# Altium schematic sheet Sheet1.SchDoc
size B
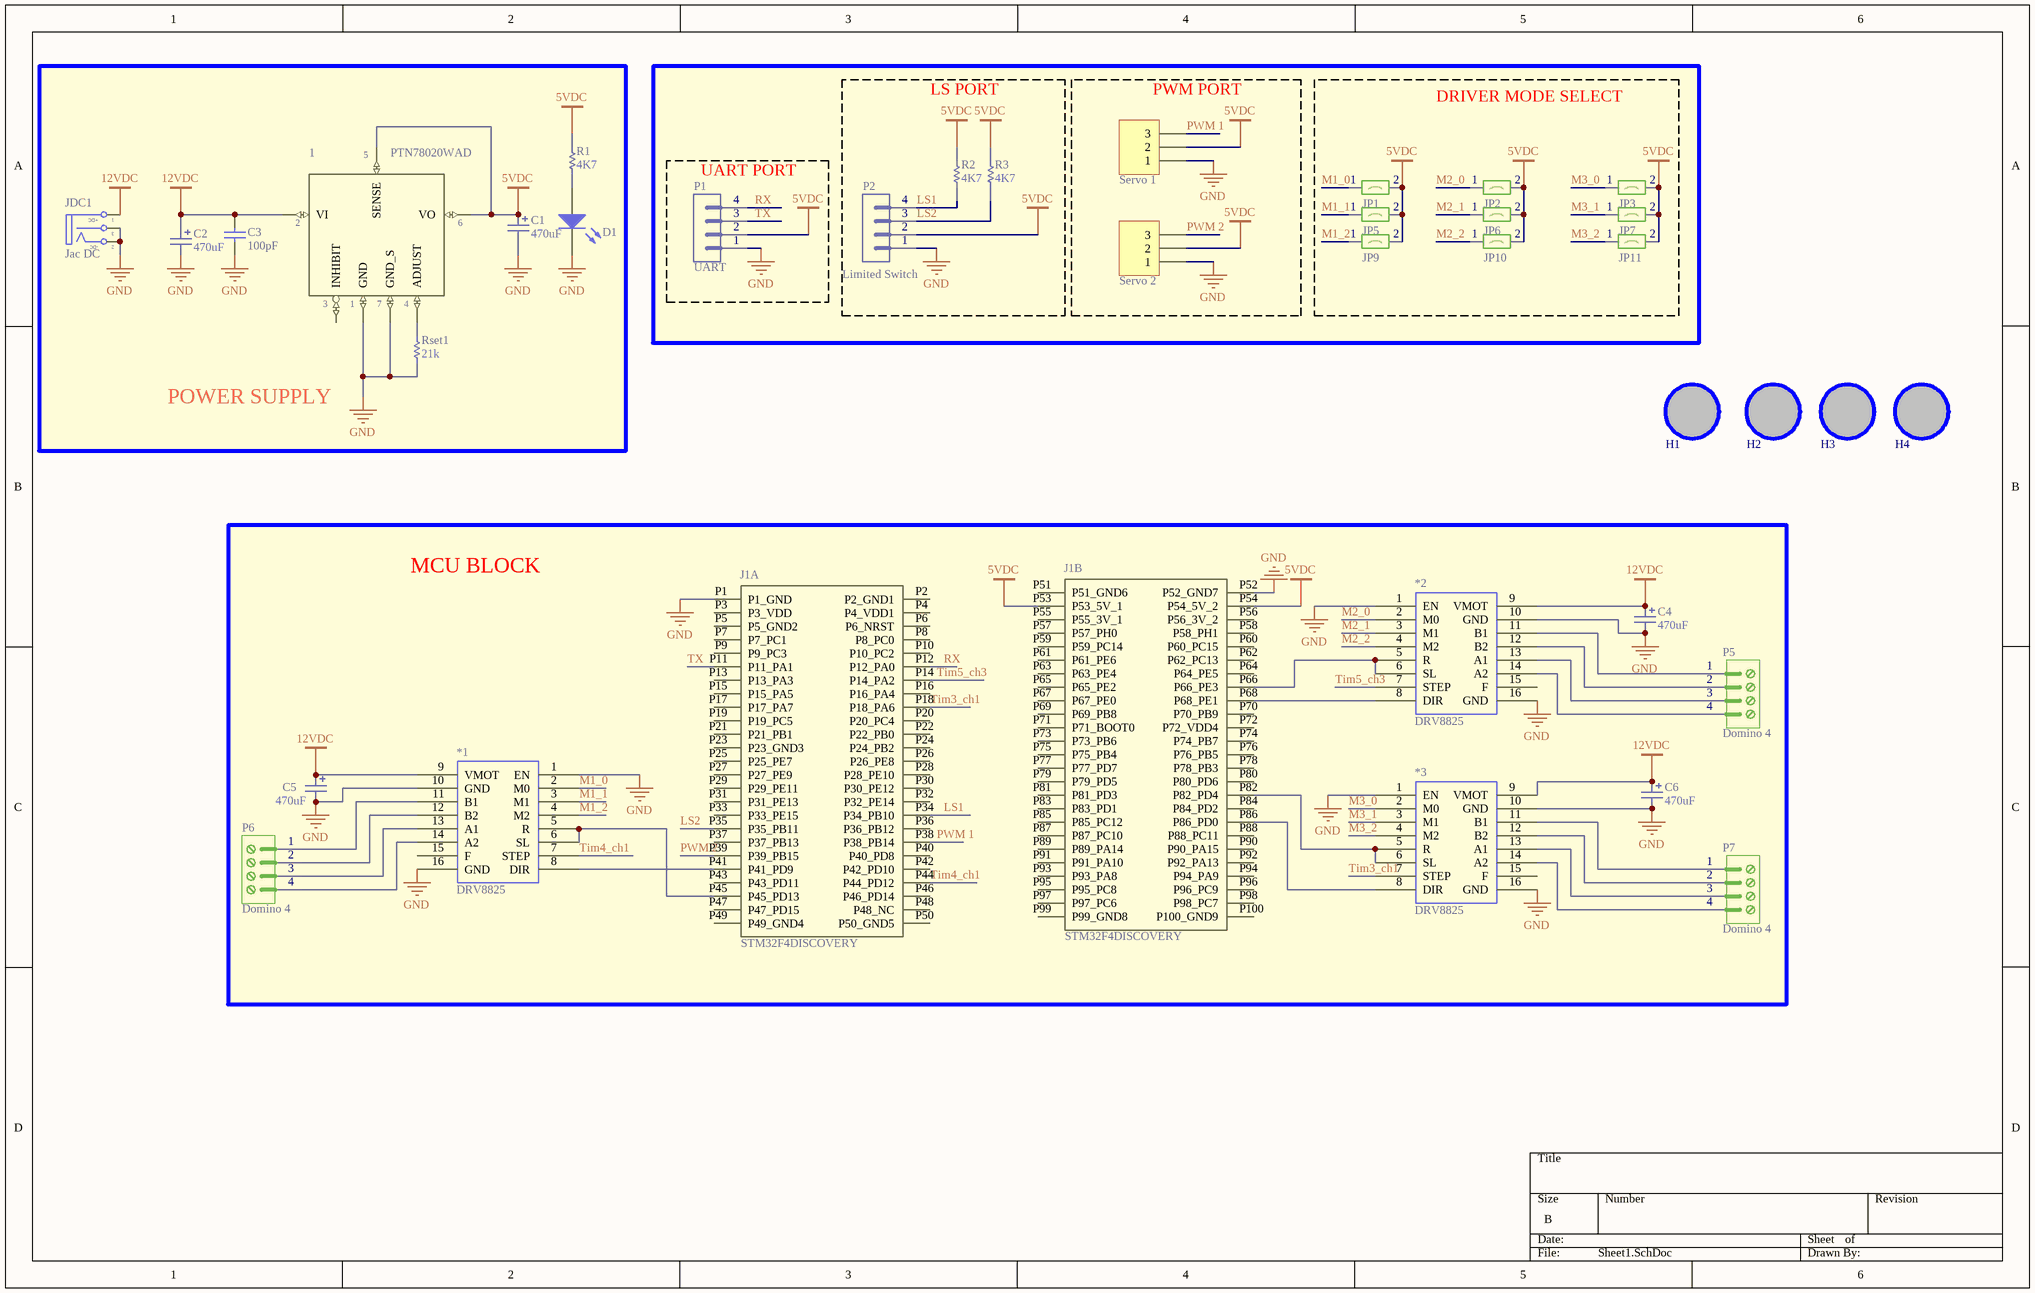
[diagram p0: Sheet1.SchDoc]

## Parts
1  PTN78020WAD  [PTN78020WAD]
*1  DRV8825  [DRV8825]
*2  DRV8825  [DRV8825]
*3  DRV8825  [DRV8825]
C1  value 470uF  [CP1/2.5]  (hidden comment: Cap Pol)
C2  value 470uF  [CP1.5/3.4]  (hidden comment: Cap Pol)
C3  value 100pF  [CAP-SM-0805]  (hidden comment: Cap Non-Pol SMD)
C4  value 470uF  [CP1/2.5]  (hidden comment: Cap Pol)
C5  value 470uF  [CP1/2.5]  (hidden comment: Cap Pol)
C6  value 470uF  [CP1/2.5]  (hidden comment: Cap Pol)
D1  LED  [LED-3mm]  (value not drawn)
H1  Hole  [LO KHOAN 3MM]  (value not drawn)
H2  Hole  [LO KHOAN 3MM]  (value not drawn)
H3  Hole  [LO KHOAN 3MM]  (value not drawn)
H4  Hole  [LO KHOAN 3MM]  (value not drawn)
J1  STM32F4DISCOVERY  [STMICROELECTRONICS_STM32F4DISCOVERY_STM32F4DISCOVERY(Primary)]  (parts A,B of 2)
JDC1  Jac DC  [DC-IN]
JP1  Jumper 2  [JP2]  (value not drawn)
JP2  Jumper 2  [JP2]  (value not drawn)
JP3  Jumper 2  [JP2]  (value not drawn)
JP5  Jumper 2  [JP2]  (value not drawn)
JP6  Jumper 2  [JP2]  (value not drawn)
JP7  Jumper 2  [JP2]  (value not drawn)
JP9  Jumper 2  [JP2]  (value not drawn)
JP10  Jumper 2  [JP2]  (value not drawn)
JP11  Jumper 2  [JP2]  (value not drawn)
P1  UART  [JP4]
P2  Limited Switch  [JP4]
P5  Domino 4  [DOMINO 4 -5mm]
P6  Domino 4  [DOMINO 4 -5mm]
P7  Domino 4  [DOMINO 4 -5mm]
R1  value 4K7  [RES-SM-0805]  (hidden comment: Res SMD)
R2  value 4K7  [RES-SM-0805]  (hidden comment: Res SMD)
R3  value 4K7  [RES-SM-0805]  (hidden comment: Res SMD)
Rset1  1%: 21k  [RES-SM-0805]  (hidden comment: Res SMD)
Servo_1  Header 3  [JP3]  (value not drawn)
Servo_2  Header 3  [JP3]  (value not drawn)

## Blocks framed on the sheet
POWER SUPPLY: 1 C1-C3 D1 JDC1 R1 Rset1
LS PORT: P2 R2 R3
PWM PORT: Servo_1 Servo_2
DRIVER MODE SELECT: JP1-JP3 JP5-JP7 JP9-JP11
UART PORT: P1
MCU BLOCK: *1-*3 C4-C6 J1 P5-P7

## Nets
5VDC: 1.5(SENSE) 1.6(VO) C1.1 J1.P53(P53_5V_1) J1.P54(P54_5V_2) JP1.2 JP2.2 JP3.2 JP5.2 JP6.2 JP7.2 JP9.2 JP10.2 JP11.2 P1.2 P2.2 R1.2 R2.2 R3.2 Servo_1.2 Servo_2.2
12VDC: 1.2(VI) *1.9(VMOT) *2.9(VMOT) *3.9(VMOT) C2.1 C3.2 C4.1 C5.1 C6.1 JDC1.1(T)
GND: 1.1(GND) 1.7(GND_S) *1.1(EN) *1.10(GND) *1.16(GND) *2.1(EN) *2.10(GND) *2.16(GND) *3.1(EN) *3.10(GND) *3.16(GND) C1.2 C2.2 C3.1 C4.2 C5.2 C6.2 D1.2(K) J1.P1(P1_GND) J1.P52(P52_GND7) JDC1.2(TN) JDC1.3(S) P1.1 P2.1 Rset1.1 Servo_1.1 Servo_2.1
LS1: J1.P34(P34_PB10) P2.4 R2.1
LS2: J1.P35(P35_PB11) P2.3 R3.1
M1_0: *1.2(M0) JP1.1
M1_1: *1.3(M1) JP5.1
M1_2: *1.4(M2) JP9.1
M2_0: *2.2(M0) JP2.1
M2_1: *2.3(M1) JP6.1
M2_2: *2.4(M2) JP10.1
M3_0: *3.2(M0) JP3.1
M3_1: *3.3(M1) JP7.1
M3_2: *3.4(M2) JP11.1
PWM 1: J1.P38(P38_PB14) Servo_1.3
PWM 2: J1.P39(P39_PB15) Servo_2.3
RX: J1.P12(P12_PA0) P1.4
Tim3_ch1: *3.7(STEP) J1.P18(P18_PA6)
Tim4_ch1: *1.7(STEP) J1.P44(P44_PD12)
Tim5_ch3: *2.7(STEP) J1.P14(P14_PA2)
TX: J1.P11(P11_PA1) P1.3
Net1_4: 1.4(ADJUST) Rset1.2
Net*1_5: *1.5(R) *1.6(SL) J1.P45(P45_PD13)
Net*1_8: *1.8(DIR) J1.P41(P41_PD9)
Net*1_11: *1.11(B1) P6.1
Net*1_12: *1.12(B2) P6.2
Net*1_13: *1.13(A1) P6.3
Net*1_14: *1.14(A2) P6.4
Net*2_5: *2.5(R) *2.6(SL) J1.P66(P66_PE3)
Net*2_8: *2.8(DIR) J1.P68(P68_PE1)
Net*2_11: *2.11(B1) P5.1
Net*2_12: *2.12(B2) P5.2
Net*2_13: *2.13(A1) P5.3
Net*2_14: *2.14(A2) P5.4
Net*3_5: *3.5(R) *3.6(SL) J1.P82(P82_PD4)
Net*3_8: *3.8(DIR) J1.P86(P86_PD0)
Net*3_11: *3.11(B1) P7.1
Net*3_12: *3.12(B2) P7.2
Net*3_13: *3.13(A1) P7.3
Net*3_14: *3.14(A2) P7.4
NetD1_1: D1.1(A) R1.1

Not connected (* = marked no-connect by the designer): 1 3(INHIBIT); *1 15(F); *2 15(F); *3 15(F); H1 1; H2 1; H3 1; H4 1; J1 P2(P2_GND1) P3(P3_VDD) P4(P4_VDD1) P5(P5_GND2) P6(P6_NRST) P7(P7_PC1) P8(P8_PC0) P9(P9_PC3) P10(P10_PC2) P13(P13_PA3) P15(P15_PA5) P16(P16_PA4) P17(P17_PA7) P19(P19_PC5) P20(P20_PC4) P21(P21_PB1) P22(P22_PB0) P23(P23_GND3) P24(P24_PB2) P25(P25_PE7) P26(P26_PE8) P27(P27_PE9) P28(P28_PE10) P29(P29_PE11) P30(P30_PE12) P31(P31_PE13) P32(P32_PE14) P33(P33_PE15) P36(P36_PB12) P37(P37_PB13) P40(P40_PD8) P42(P42_PD10) P43(P43_PD11) P46(P46_PD14) P47(P47_PD15) P48(P48_NC) P49(P49_GND4) P50(P50_GND5) P51(P51_GND6) P55(P55_3V_1) P56(P56_3V_2) P57(P57_PH0) P58(P58_PH1) P59(P59_PC14) P60(P60_PC15) P61(P61_PE6) P62(P62_PC13) P63(P63_PE4) P64(P64_PE5) P65(P65_PE2) P67(P67_PE0) P69(P69_PB8) P70(P70_PB9) P71(P71_BOOT0) P72(P72_VDD4) P73(P73_PB6) P74(P74_PB7) P75(P75_PB4) P76(P76_PB5) P77(P77_PD7) P78(P78_PB3) P79(P79_PD5) P80(P80_PD6) P81(P81_PD3) P83(P83_PD1) P84(P84_PD2) P85(P85_PC12) P87(P87_PC10) P88(P88_PC11) P89(P89_PA14) P90(P90_PA15) P91(P91_PA10) P92(P92_PA13) P93(P93_PA8) P94(P94_PA9) P95(P95_PC8) P96(P96_PC9) P97(P97_PC6) P98(P98_PC7) P99(P99_GND8) P100(P100_GND9)

## Notes on the sheet
- (in symbol DCIN) +DC; -DC

## Library data of the parts
1 = PTN78020WAD: 6-A Wide-Input Voltage Adjustable Switching egulator 7-Through-Hole Module -40 to 85; MF: Texas Instruments; Price: None; MP: PTN78020WAD; SnapEDA_Link: https://www.snapeda.com/parts/PTN78020WAD/Texas%20Instruments/view-part/?ref=snap; Availability: Unavailable; Package: DIP-7 Texas Instruments; Value: *
C1 C2 C4-C6 = Cap Pol: Polarized Capacitor (Radial)
C3 = Cap Non-Pol SMD: Capacitor
H1-H4 = Hole: Hole 3mm
J1 = STM32F4DISCOVERY: Development kit: ARM ST; pin strips, pin header; No.of; MF: STMicroelectronics; Package: None; SnapEDA_Link: https://www.snapeda.com/parts/STM32F4DISCOVERY/STMicroelectronics/view-part/?ref=snap; Price: None; MP: STM32F4DISCOVERY; Availability: Unavailable; Value: *
JDC1 = DCIN: Jac DC input; Value: Jac DC
P1 P2 = Header 4: Header, 4-Pin; LatestRevisionDate: 17-Jul-2002; LatestRevisionNote: Re-released for DXP Platform.; Publisher: Altium Limited
P5-P7 = Domino 4: Domino 4-Pin; LatestRevisionDate: 17-Jul-2002; LatestRevisionNote: Re-released for DXP Platform.; Publisher: Altium Limited
R1-R3 Rset1 = Res SMD: Resistor
Servo_1 Servo_2 = Header 3: Header, 3-Pin; LatestRevisionDate: 17-Jul-2002; LatestRevisionNote: Re-released for DXP Platform.; Publisher: Altium Limited